# Altium schematic sheet Power Amplifier.SchDoc
size A4
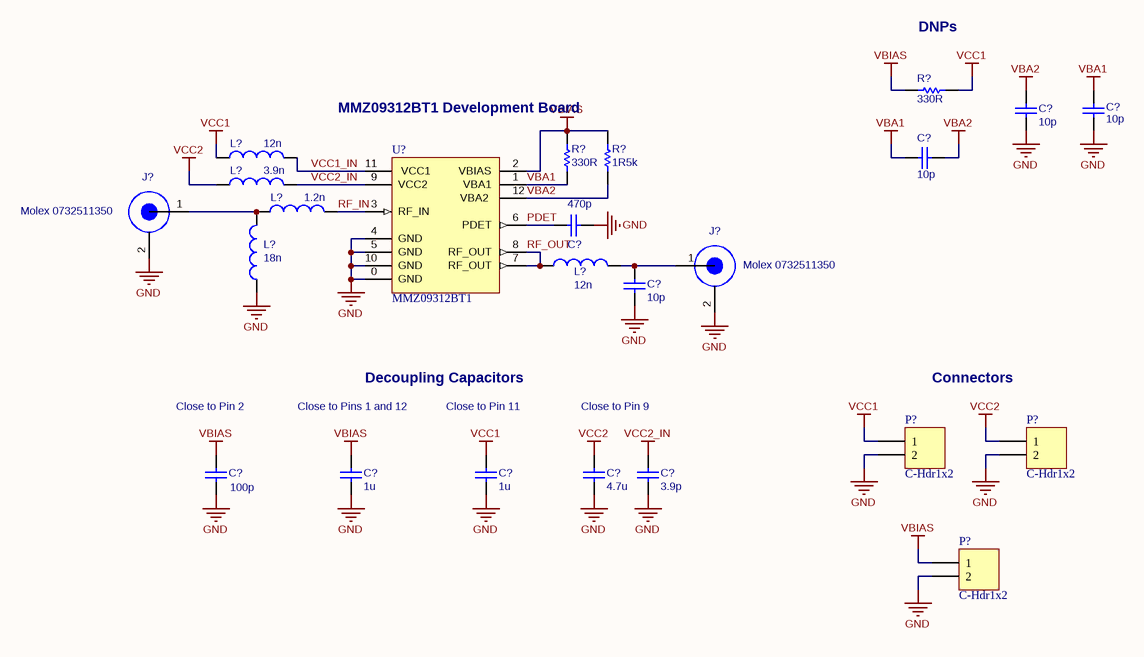
[diagram p0: Power Amplifier.SchDoc]

## Parts
(Parts that share a designator on the sheet are numbered #1, #2 ... from top to bottom, then left to right.)
C?#1  10p  [CAP 1005 (0402) B-Density]
C?#2  10p  [CAP 1005 (0402) B-Density]
C?#3  10p  [CAP 1005 (0402) B-Density]
C?#4  470p  [CAP 1005 (0402) B-Density]
C?#5  10p  [CAP 1005 (0402) B-Density]
C?#6  100p  [CAP 1005 (0402) B-Density]
C?#7  1u  [CAP 1005 (0402) B-Density]
C?#8  1u  [CAP 1005 (0402) B-Density]
C?#9  4.7u  [CAP 1608 (0603) B-Density]
C?#10  3.9p  [CAP 1005 (0402) B-Density]
J?#1  Molex 0732511350  [MOLEX 732511350]
J?#2  Molex 0732511350  [MOLEX 732511350]
L?#1  12n  [IND 1608 (0603)]
L?#2  3.9n  [IND 1608 (0603)]
L?#3  1.2n  [IND 1608 (0603)]
L?#4  12n  [IND 1608 (0603)]
L?#5  18n  [IND 1608 (0603)]
P?#1  C-Hdr1x2  [HDR1X2_LGE1.0]
P?#2  C-Hdr1x2  [HDR1X2_LGE1.0]
P?#3  C-Hdr1x2  [HDR1X2_LGE1.0]
R?#1  330R  [RES 1005 (0402)]
R?#2  330R  [RES 1005 (0402)]
R?#3  1R5k  [RES 1005 (0402)]
U?  MMZ09312BT1  [QFN 3x3]

## Nets
GND: C?#1.1 C?#2.1 C?#4.2 C?#5.1 C?#6.1 C?#7.1 C?#8.1 C?#9.1 C?#10.1 J?#1.2 J?#2.2 L?#5.1 P?#1.2 P?#2.2 P?#3.2 U?.0(GND) U?.4(GND) U?.5(GND) U?.10(GND)
VBA1: C?#2.2 C?#3.2 R?#2.1 U?.1(VBA1)
VBA2: C?#1.2 C?#3.1 R?#3.1 U?.12(VBA2)
VBIAS: C?#6.2 C?#7.2 P?#3.1 R?#1.2 R?#2.2 R?#3.2 U?.2(VBIAS)
VCC1: C?#8.2 L?#1.1 P?#1.1 R?#1.1
VCC2: C?#9.2 L?#2.1 P?#2.1
VCC2_IN: C?#10.2 L?#2.2 U?.9(VCC2)
PDET: C?#4.1 U?.6(PDET)
RF_IN: L?#3.2 U?.3(RF_IN)
RF_OUT: L?#4.1 U?.7(RF_OUT) U?.8(RF_OUT)
VCC1_IN: L?#1.2 U?.11(VCC1)
NetC?#5_2: C?#5.2 J?#2.1 L?#4.2
NetJ?#1_1: J?#1.1 L?#3.1 L?#5.2

## Notes on the sheet
- DNPs
- (near R?#2) MMZ09312BT1 Development Board
- Decoupling Capacitors
- Connectors
- Close to Pin 2
- Close to Pins 1 and 12
- Close to Pin 11
- Close to Pin 9

## Library data of the parts
C?#1-C?#10 = CAPACITOR (GENERAL): Capacitor; Supplier 1: Digi-Key
  C?#1-C?#3 C?#5: Supplier Part Number 1: 490-3113-1-ND; Value: *
  C?#4: Supplier Part Number 1: 490-1297-1-ND; Value: *
  C?#6: Supplier Part Number 1: 399-3194-1-ND; Value: *
  C?#7: Supplier Part Number 1: 1276-1076-1-ND; Value: 1u
  C?#8: Supplier Part Number 1: 1276-1076-1-ND; Value: *
  C?#9: Supplier Part Number 1: 490-7203-1-ND; Value: *
  C?#10: Supplier Part Number 1: 478-4424-1-ND; Value: *
J?#1 J?#2 = SMA CONNECTOR (GENERAL): Supplier 1: Digi-Key; Supplier Part Number 1: WM9357-ND
L?#1-L?#5 = INDUCTOR (GENERAL): Inductor; Supplier 1: Digi-Key; Value: *
  L?#1 L?#4: Supplier Part Number 1: 490-17900-1-ND
  L?#2: Supplier Part Number 1: 490-1105-1-ND
  L?#3: Supplier Part Number 1: 490-1099-1-ND
  L?#5: Supplier Part Number 1: 490-6577-1-ND
P?#1-P?#3 = C-Hdr1x2: Header, 2-Pin; LatestRevisionDate: 17-Jul-2002; LatestRevisionNote: Re-released for DXP Platform.; Publisher: Altium Limited; Supplier 1: Digi-Key; Supplier Part Number 1: 732-5315-ND
R?#1-R?#3 = RESISTOR (GENERAL): Resistor; Supplier 1: Digi-Key; Value: *
  R?#1 R?#2: Supplier Part Number 1: 311-330JRCT-ND
  R?#3: Supplier Part Number 1: 311-1.50KLRCT-ND
U? = MMZ09312BT1: IC RF AMP CDMA 400MHZ-1GHZ 12QFN; Supplier 1: Digi-Key; Supplier Part Number 1: MMZ09312BT1TR-ND